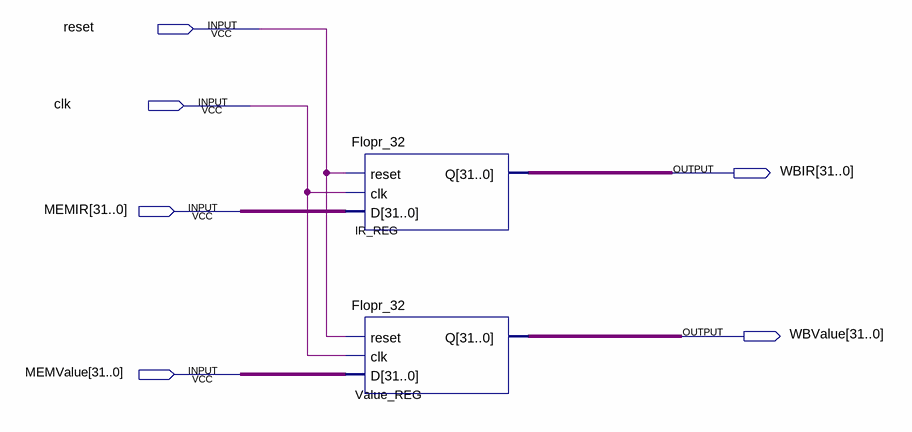
[diagram p0: schematic sheet]
// Quartus schematic MEMWBTower.bdf as structural Verilog: 2 symbols, 6 pins
module MEMWBTower (
  input  reset,
  input  clk,
  input  [31:0] MEMIR,
  input  [31:0] MEMValue,
  output [31:0] WBIR,
  output [31:0] WBValue
);

  Flopr_32 IR_REG (.reset(reset), .clk(clk), .D(MEMIR), .Q(WBIR));
  Flopr_32 Value_REG (.reset(reset), .clk(clk), .D(MEMValue), .Q(WBValue));
endmodule
